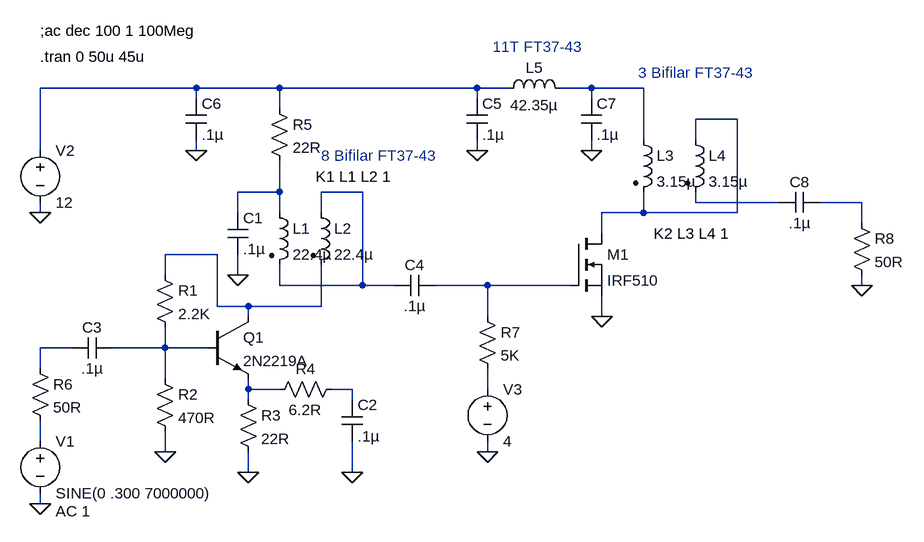
[diagram p0: schematic Bitx20 Power Amp.asc]
Bitx20 Power Amp.asc, the LTspice schematic file:
Version 4
SHEET 1 1192 680
WIRE 96 -208 -144 -208
WIRE 224 -208 96 -208
WIRE 528 -208 224 -208
WIRE 576 -208 528 -208
WIRE 704 -208 656 -208
WIRE 784 -208 704 -208
WIRE 96 -192 96 -208
WIRE 528 -192 528 -208
WIRE 704 -192 704 -208
WIRE 224 -176 224 -208
WIRE 928 -160 864 -160
WIRE 784 -128 784 -208
WIRE 864 -128 864 -160
WIRE -144 -112 -144 -208
WIRE 96 -112 96 -128
WIRE 528 -112 528 -128
WIRE 704 -112 704 -128
WIRE 224 -48 224 -96
WIRE 224 -48 160 -48
WIRE 352 -48 288 -48
WIRE 864 -32 864 -48
WIRE 992 -32 864 -32
WIRE 1120 -32 1056 -32
WIRE -144 -16 -144 -32
WIRE 160 -16 160 -48
WIRE 224 -16 224 -48
WIRE 288 -16 288 -48
WIRE 784 -16 784 -48
WIRE 784 -16 720 -16
WIRE 928 -16 928 -160
WIRE 928 -16 784 -16
WIRE 1120 0 1120 -32
WIRE 720 16 720 -16
WIRE 128 48 48 48
WIRE 48 80 48 48
WIRE 160 80 160 48
WIRE 224 96 224 64
WIRE 352 96 352 -48
WIRE 352 96 224 96
WIRE 400 96 352 96
WIRE 544 96 464 96
WIRE 672 96 544 96
WIRE 1120 96 1120 80
WIRE 128 128 128 48
WIRE 176 128 128 128
WIRE 288 128 288 64
WIRE 288 128 176 128
WIRE 176 144 176 128
WIRE 544 144 544 96
WIRE 720 144 720 112
WIRE -96 192 -144 192
WIRE 48 192 48 160
WIRE 48 192 -32 192
WIRE 112 192 48 192
WIRE -144 224 -144 192
WIRE 48 240 48 192
WIRE 176 256 176 240
WIRE 224 256 176 256
WIRE 336 256 304 256
WIRE 544 256 544 224
WIRE 176 272 176 256
WIRE 336 272 336 256
WIRE -144 336 -144 304
WIRE 48 352 48 320
WIRE 544 352 544 336
WIRE 176 384 176 352
WIRE 336 384 336 336
WIRE -144 432 -144 416
FLAG 48 352 0
FLAG 176 384 0
FLAG 336 384 0
FLAG -144 432 0
FLAG -144 -16 0
FLAG 160 80 0
FLAG 544 352 0
FLAG 720 144 0
FLAG 528 -112 0
FLAG 96 -112 0
FLAG 704 -112 0
FLAG 1120 96 0
SYMBOL npn 112 144 R0
SYMATTR InstName Q1
SYMATTR Value 2N2219A
SYMBOL res 32 64 R0
SYMATTR InstName R1
SYMATTR Value 2.2K
SYMBOL res 32 224 R0
SYMATTR InstName R2
SYMATTR Value 470R
SYMBOL res 160 256 R0
SYMATTR InstName R3
SYMATTR Value 22R
SYMBOL res 320 240 R90
WINDOW 0 0 56 VBottom 2
WINDOW 3 32 56 VTop 2
SYMATTR InstName R4
SYMATTR Value 6.2R
SYMBOL voltage -144 320 R0
WINDOW 123 24 124 Left 2
WINDOW 39 0 0 Left 2
SYMATTR InstName V1
SYMATTR Value SINE(0 .300 7000000)
SYMATTR Value2 AC 1
SYMBOL voltage -144 -128 R0
WINDOW 123 0 0 Left 2
WINDOW 39 0 0 Left 2
SYMATTR InstName V2
SYMATTR Value 12
SYMBOL ind2 208 -32 R0
SYMATTR InstName L1
SYMATTR Value 22.4µ
SYMATTR Type ind
SYMBOL ind2 272 -32 R0
SYMATTR InstName L2
SYMATTR Value 22.4µ
SYMATTR Type ind
SYMBOL res 208 -192 R0
SYMATTR InstName R5
SYMATTR Value 22R
SYMBOL cap 144 -16 R0
SYMATTR InstName C1
SYMATTR Value .1µ
SYMBOL cap 320 272 R0
SYMATTR InstName C2
SYMATTR Value .1µ
SYMBOL res -160 208 R0
SYMATTR InstName R6
SYMATTR Value 50R
SYMBOL cap -32 176 R90
WINDOW 0 0 32 VBottom 2
WINDOW 3 32 32 VTop 2
SYMATTR InstName C3
SYMATTR Value .1µ
SYMBOL cap 464 80 R90
WINDOW 0 0 32 VBottom 2
WINDOW 3 32 32 VTop 2
SYMATTR InstName C4
SYMATTR Value .1µ
SYMBOL voltage 544 240 R0
WINDOW 123 0 0 Left 2
WINDOW 39 0 0 Left 2
SYMATTR InstName V3
SYMATTR Value 4
SYMBOL res 528 128 R0
SYMATTR InstName R7
SYMATTR Value 5K
SYMBOL nmos 672 16 R0
SYMATTR InstName M1
SYMATTR Value IRF510
SYMBOL ind2 768 -144 R0
SYMATTR InstName L3
SYMATTR Value 3.15µ
SYMATTR Type ind
SYMBOL ind2 848 -144 R0
SYMATTR InstName L4
SYMATTR Value 3.15µ
SYMATTR Type ind
SYMBOL ind 560 -192 R270
WINDOW 0 32 56 VTop 2
WINDOW 3 5 56 VBottom 2
SYMATTR InstName L5
SYMATTR Value 42.35µ
SYMBOL cap 512 -192 R0
SYMATTR InstName C5
SYMATTR Value .1µ
SYMBOL cap 80 -192 R0
SYMATTR InstName C6
SYMATTR Value .1µ
SYMBOL cap 688 -192 R0
SYMATTR InstName C7
SYMATTR Value .1µ
SYMBOL cap 1056 -48 R90
WINDOW 0 0 32 VBottom 2
WINDOW 3 32 32 VTop 2
SYMATTR InstName C8
SYMATTR Value .1µ
SYMBOL res 1104 -16 R0
SYMATTR InstName R8
SYMATTR Value 50R
TEXT 280 -72 Left 2 !K1 L1 L2 1
TEXT 800 16 Left 2 !K2 L3 L4 1
TEXT 552 -272 Left 2 ;11T FT37-43
TEXT 776 -232 Left 2 ;3 Bifilar FT37-43
TEXT 288 -104 Left 2 ;8 Bifilar FT37-43
TEXT -144 -296 Left 2 !;ac dec 100 1 100Meg
TEXT -144 -256 Left 2 !.tran 0 50u 45u

The netlist it stands for:
* Bitx20 Power Amp.asc
Q1 N008 N011 N012 0 2N2219A
R1 N008 N011 2.2K
R2 N011 0 470R
R3 N012 0 22R
R4 N013 N012 6.2R
V1 N015 0 SINE(0 .300 7000000) AC 1
V2 N001 0 12
L1 N004 N005 22.4µ
L2 N005 N008 22.4µ
R5 N001 N004 22R
C1 N004 0 .1µ
C2 N013 0 .1µ
R6 N010 N015 50R
C3 N011 N010 .1µ
C4 N009 N005 .1µ
V3 N014 0 4
R7 N009 N014 5K
M1 N003 N009 0 0 IRF510
L3 N002 N003 3.15µ
L4 N003 N006 3.15µ
L5 N001 N002 42.35µ
C5 N001 0 .1µ
C6 N001 0 .1µ
C7 N002 0 .1µ
C8 N007 N006 .1µ
R8 N007 0 50R
.model NPN NPN
.model PNP PNP
.lib standard.bjt
.model NMOS NMOS
.model PMOS PMOS
.lib standard.mos
K1 L1 L2 1
K2 L3 L4 1
* 11T FT37-43
* 3 Bifilar FT37-43
* 8 Bifilar FT37-43
;ac dec 100 1 100Meg
.tran 0 50u 45u
.backanno
.end